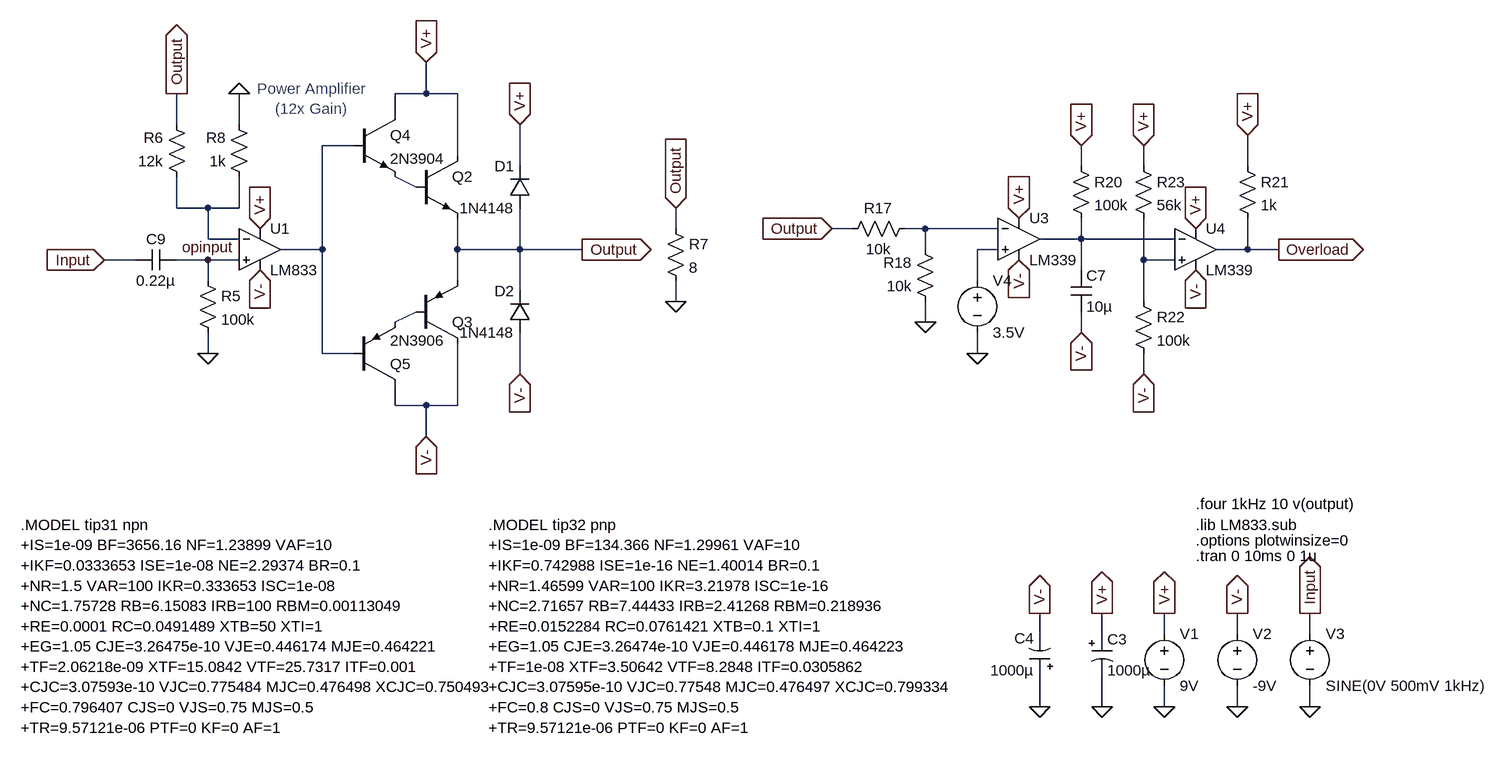
[diagram p0: schematic Simulation.asc]
Simulation.asc, the LTspice schematic file:
Version 4
SHEET 1 3212 680
WIRE 688 -352 688 -400
WIRE 688 -352 640 -352
WIRE 736 -352 688 -352
WIRE 640 -320 640 -352
WIRE 304 -304 304 -352
WIRE 400 -304 400 -352
WIRE 576 -272 528 -272
WIRE 736 -256 736 -352
WIRE 832 -240 832 -304
WIRE 1696 -240 1696 -272
WIRE 1792 -240 1792 -272
WIRE 1952 -240 1952 -288
WIRE 672 -208 640 -224
WIRE 304 -176 304 -224
WIRE 352 -176 304 -176
WIRE 400 -176 400 -224
WIRE 400 -176 352 -176
WIRE 1072 -144 1072 -176
WIRE 1344 -144 1312 -144
WIRE 1456 -144 1424 -144
WIRE 1568 -144 1456 -144
WIRE 352 -128 352 -176
WIRE 400 -128 352 -128
WIRE 1696 -128 1696 -160
WIRE 1696 -128 1632 -128
WIRE 1840 -128 1696 -128
WIRE 528 -112 528 -272
WIRE 528 -112 464 -112
WIRE 736 -112 736 -160
WIRE 832 -112 832 -176
WIRE 832 -112 736 -112
WIRE 928 -112 832 -112
WIRE 1456 -112 1456 -144
WIRE 1568 -112 1536 -112
WIRE 1952 -112 1952 -160
WIRE 1952 -112 1904 -112
WIRE 2000 -112 1952 -112
WIRE 240 -96 192 -96
WIRE 352 -96 304 -96
WIRE 400 -96 352 -96
WIRE 1792 -96 1792 -160
WIRE 1840 -96 1792 -96
WIRE 1696 -80 1696 -128
WIRE 352 -64 352 -96
WIRE 736 -64 736 -112
WIRE 1536 -64 1536 -112
WIRE 832 -48 832 -112
WIRE 1072 -32 1072 -64
WIRE 1792 -32 1792 -96
WIRE 640 0 672 -16
WIRE 1456 0 1456 -32
WIRE 1696 16 1696 -16
WIRE 352 48 352 16
WIRE 528 48 528 -112
WIRE 576 48 528 48
WIRE 1536 48 1536 16
WIRE 832 80 832 16
WIRE 1792 80 1792 48
WIRE 640 128 640 96
WIRE 688 128 640 128
WIRE 736 128 736 32
WIRE 736 128 688 128
WIRE 688 176 688 128
WIRE 1632 480 1632 448
WIRE 1728 480 1728 448
WIRE 1824 480 1824 448
WIRE 1936 480 1936 448
WIRE 2048 480 2048 448
WIRE 1632 592 1632 544
WIRE 1728 592 1728 544
WIRE 1824 592 1824 560
WIRE 1936 592 1936 560
WIRE 2048 592 2048 560
FLAG 1824 592 0
FLAG 1936 592 0
FLAG 2048 592 0
FLAG 1824 448 V+
IOPIN 1824 448 Out
FLAG 1936 448 V-
IOPIN 1936 448 Out
FLAG 2048 448 Input
IOPIN 2048 448 Out
FLAG 432 -144 V+
IOPIN 432 -144 In
FLAG 432 -80 V-
IOPIN 432 -80 In
FLAG 928 -112 Output
IOPIN 928 -112 Out
FLAG 1072 -32 0
FLAG 1072 -176 Output
IOPIN 1072 -176 In
FLAG 688 176 V-
IOPIN 688 176 In
FLAG 688 -400 V+
IOPIN 688 -400 In
FLAG 352 48 0
FLAG 832 -304 V+
IOPIN 832 -304 In
FLAG 832 80 V-
IOPIN 832 80 In
FLAG 1728 448 V+
IOPIN 1728 448 Out
FLAG 1728 592 0
FLAG 1632 592 0
FLAG 1632 448 V-
IOPIN 1632 448 Out
FLAG 304 -352 Output
IOPIN 304 -352 Out
FLAG 352 -96 opinput
FLAG 1536 48 0
FLAG 1600 -160 V+
IOPIN 1600 -160 In
FLAG 1696 -272 V+
IOPIN 1696 -272 In
FLAG 1872 -144 V+
IOPIN 1872 -144 In
FLAG 1952 -288 V+
IOPIN 1952 -288 In
FLAG 2000 -112 Overload
IOPIN 2000 -112 Out
FLAG 1792 -272 V+
IOPIN 1792 -272 In
FLAG 1600 -96 V-
IOPIN 1600 -96 In
FLAG 1872 -80 V-
IOPIN 1872 -80 In
FLAG 1456 0 0
FLAG 1312 -144 Output
IOPIN 1312 -144 In
FLAG 192 -96 Input
IOPIN 192 -96 In
FLAG 400 -352 0
FLAG 1696 16 V-
IOPIN 1696 16 In
FLAG 1792 80 V-
IOPIN 1792 80 In
SYMBOL voltage 1824 464 R0
WINDOW 123 0 0 Left 2
WINDOW 39 24 124 Left 2
SYMATTR InstName V1
SYMATTR Value 9V
SYMBOL voltage 1936 464 R0
WINDOW 123 0 0 Left 2
WINDOW 39 24 124 Left 2
SYMATTR InstName V2
SYMATTR Value -9V
SYMBOL voltage 2048 464 R0
WINDOW 123 0 0 Left 2
WINDOW 39 0 0 Left 2
SYMATTR InstName V3
SYMATTR Value SINE(0V 500mV 1kHz)
SYMBOL res 336 -80 R0
SYMATTR InstName R5
SYMATTR Value 100k
SYMBOL Opamps\\opamp2 432 -176 R0
SYMATTR InstName U1
SYMATTR Value LM833
SYMBOL npn 672 -256 R0
SYMATTR InstName Q2
SYMATTR Value ""
SYMATTR SpiceModel TIP31
SYMBOL pnp 672 32 M180
SYMATTR InstName Q3
SYMATTR Value ""
SYMATTR SpiceModel TIP32
SYMBOL res 1056 -160 R0
SYMATTR InstName R7
SYMATTR Value 8
SYMBOL npn 576 -320 R0
SYMATTR InstName Q4
SYMATTR Value 2N3904
SYMBOL pnp 576 96 M180
SYMATTR InstName Q5
SYMATTR Value 2N3906
SYMBOL diode 848 -176 R180
WINDOW 0 24 64 Left 2
WINDOW 3 24 0 Left 2
SYMATTR InstName D1
SYMATTR Value 1N4148
SYMBOL diode 848 16 R180
WINDOW 0 24 64 Left 2
WINDOW 3 24 0 Left 2
SYMATTR InstName D2
SYMATTR Value 1N4148
SYMBOL polcap 1712 480 R0
SYMATTR InstName C3
SYMATTR Value 1000µ
SYMBOL polcap 1648 544 R180
WINDOW 0 24 57 Left 2
WINDOW 3 24 8 Left 2
SYMATTR InstName C4
SYMATTR Value 1000µ
SYMBOL voltage 1536 -80 R0
WINDOW 123 0 0 Left 2
WINDOW 39 24 124 Left 2
SYMATTR InstName V4
SYMATTR Value 3.5V
SYMBOL Comparators\\LM339 1600 -192 R0
SYMATTR InstName U3
SYMBOL res 1680 -256 R0
SYMATTR InstName R20
SYMATTR Value 100k
SYMBOL cap 1680 -80 R0
SYMATTR InstName C7
SYMATTR Value 10µ
SYMBOL Comparators\\LM339 1872 -176 R0
SYMATTR InstName U4
SYMBOL res 1936 -256 R0
SYMATTR InstName R21
SYMATTR Value 1k
SYMBOL res 1776 -48 R0
SYMATTR InstName R22
SYMATTR Value 100k
SYMBOL res 1776 -256 R0
SYMATTR InstName R23
SYMATTR Value 56k
SYMBOL res 1440 -160 R90
WINDOW 0 0 56 VBottom 2
WINDOW 3 32 56 VTop 2
SYMATTR InstName R17
SYMATTR Value 10k
SYMBOL res 1472 -16 R180
WINDOW 0 36 76 Left 2
WINDOW 3 36 40 Left 2
SYMATTR InstName R18
SYMATTR Value 10k
SYMBOL cap 304 -112 R90
WINDOW 0 0 32 VBottom 2
WINDOW 3 32 32 VTop 2
SYMATTR InstName C9
SYMATTR Value 0.22µ
SYMBOL res 320 -208 R180
WINDOW 0 36 76 Left 2
WINDOW 3 36 40 Left 2
SYMATTR InstName R6
SYMATTR Value 12k
SYMBOL res 416 -208 R180
WINDOW 0 36 76 Left 2
WINDOW 3 36 40 Left 2
SYMATTR InstName R8
SYMATTR Value 1k
TEXT 1872 360 Left 2 !.tran 0 10ms 0 1u
TEXT 1872 336 Left 2 !.options plotwinsize=0
TEXT 1872 312 Left 2 !.lib LM833.sub
TEXT 64 312 Left 2 !.MODEL tip31 npn\n+IS=1e-09 BF=3656.16 NF=1.23899 VAF=10\n+IKF=0.0333653 ISE=1e-08 NE=2.29374 BR=0.1\n+NR=1.5 VAR=100 IKR=0.333653 ISC=1e-08\n+NC=1.75728 RB=6.15083 IRB=100 RBM=0.00113049\n+RE=0.0001 RC=0.0491489 XTB=50 XTI=1\n+EG=1.05 CJE=3.26475e-10 VJE=0.446174 MJE=0.464221\n+TF=2.06218e-09 XTF=15.0842 VTF=25.7317 ITF=0.001\n+CJC=3.07593e-10 VJC=0.775484 MJC=0.476498 XCJC=0.750493\n+FC=0.796407 CJS=0 VJS=0.75 MJS=0.5\n+TR=9.57121e-06 PTF=0 KF=0 AF=1
TEXT 784 312 Left 2 !.MODEL tip32 pnp\n+IS=1e-09 BF=134.366 NF=1.29961 VAF=10\n+IKF=0.742988 ISE=1e-16 NE=1.40014 BR=0.1\n+NR=1.46599 VAR=100 IKR=3.21978 ISC=1e-16\n+NC=2.71657 RB=7.44433 IRB=2.41268 RBM=0.218936\n+RE=0.0152284 RC=0.0761421 XTB=0.1 XTI=1\n+EG=1.05 CJE=3.26474e-10 VJE=0.446178 MJE=0.464223\n+TF=1e-08 XTF=3.50642 VTF=8.2848 ITF=0.0305862\n+CJC=3.07595e-10 VJC=0.77548 MJC=0.476497 XCJC=0.799334\n+FC=0.8 CJS=0 VJS=0.75 MJS=0.5\n+TR=9.57121e-06 PTF=0 KF=0 AF=1
TEXT 1872 280 Left 2 !.four 1kHz 10 v(output)
TEXT 512 -344 Center 2 ;Power Amplifier\n(12x Gain)

The netlist it stands for:
* Simulation.asc
V1 V+ 0 9V
V2 V- 0 -9V
V3 Input 0 SINE(0V 500mV 1kHz)
R5 opinput 0 100k
XU1 opinput N003 V+ V- N001 LM833  ; pins In+ In- V+ V- OUT
Q2 V+ N002 Output 0 TIP31
Q3 V- N008 Output 0 TIP32
R7 Output 0 8
Q4 V+ N001 N002 0 2N3904
Q5 V- N001 N008 0 2N3906
D1 Output V+ 1N4148
D2 V- Output 1N4148
C3 V+ 0 1000µ
C4 0 V- 1000µ
V4 N006 0 3.5V
XU3 N006 N004 V+ V- N005 LM339  ; pins In+ In- V+ V- OUT
R20 V+ N005 100k
C7 N005 V- 10µ
XU4 N007 N005 V+ V- Overload LM339  ; pins In+ In- V+ V- OUT
R21 V+ Overload 1k
R22 N007 V- 100k
R23 V+ N007 56k
R17 N004 Output 10k
R18 0 N004 10k
C9 opinput Input 0.22µ
R6 N003 Output 12k
R8 N003 0 1k
.model D D
.lib standard.dio
.model NPN NPN
.model PNP PNP
.lib standard.bjt
.tran 0 10ms 0 1u
.options plotwinsize=0
.lib LM833.sub
.MODEL tip31 npn
+IS=1e-09 BF=3656.16 NF=1.23899 VAF=10
+IKF=0.0333653 ISE=1e-08 NE=2.29374 BR=0.1
+NR=1.5 VAR=100 IKR=0.333653 ISC=1e-08
+NC=1.75728 RB=6.15083 IRB=100 RBM=0.00113049
+RE=0.0001 RC=0.0491489 XTB=50 XTI=1
+EG=1.05 CJE=3.26475e-10 VJE=0.446174 MJE=0.464221
+TF=2.06218e-09 XTF=15.0842 VTF=25.7317 ITF=0.001
+CJC=3.07593e-10 VJC=0.775484 MJC=0.476498 XCJC=0.750493
+FC=0.796407 CJS=0 VJS=0.75 MJS=0.5
+TR=9.57121e-06 PTF=0 KF=0 AF=1
.MODEL tip32 pnp
+IS=1e-09 BF=134.366 NF=1.29961 VAF=10
+IKF=0.742988 ISE=1e-16 NE=1.40014 BR=0.1
+NR=1.46599 VAR=100 IKR=3.21978 ISC=1e-16
+NC=2.71657 RB=7.44433 IRB=2.41268 RBM=0.218936
+RE=0.0152284 RC=0.0761421 XTB=0.1 XTI=1
+EG=1.05 CJE=3.26474e-10 VJE=0.446178 MJE=0.464223
+TF=1e-08 XTF=3.50642 VTF=8.2848 ITF=0.0305862
+CJC=3.07595e-10 VJC=0.77548 MJC=0.476497 XCJC=0.799334
+FC=0.8 CJS=0 VJS=0.75 MJS=0.5
+TR=9.57121e-06 PTF=0 KF=0 AF=1
.four 1kHz 10 v(output)
* Power Amplifier
* (12x Gain)
.lib LM339.sub
.backanno
.end